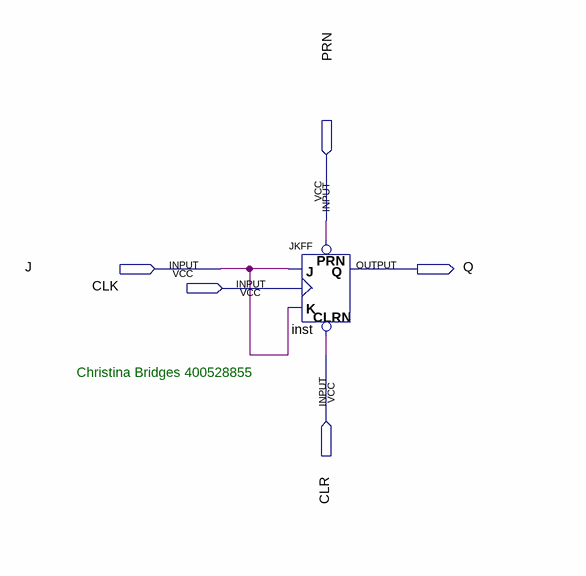
[diagram p0: schematic sheet]
// Quartus schematic prelab4.bdf as structural Verilog: 1 symbols, 5 pins
module prelab4 (
  input  PRN,
  input  J,
  input  CLK,
  input  CLR,
  output Q
);

  JKFF inst (.PRN(PRN), .CLRN(CLR), .K(J), .J(J), .CLK(CLK));  // open: Q

  // Notes on the sheet:
  //   Christina Bridges 400528855
endmodule
